# Altium schematic sheet rev02_15.SchDoc
size 282 x 200 mm
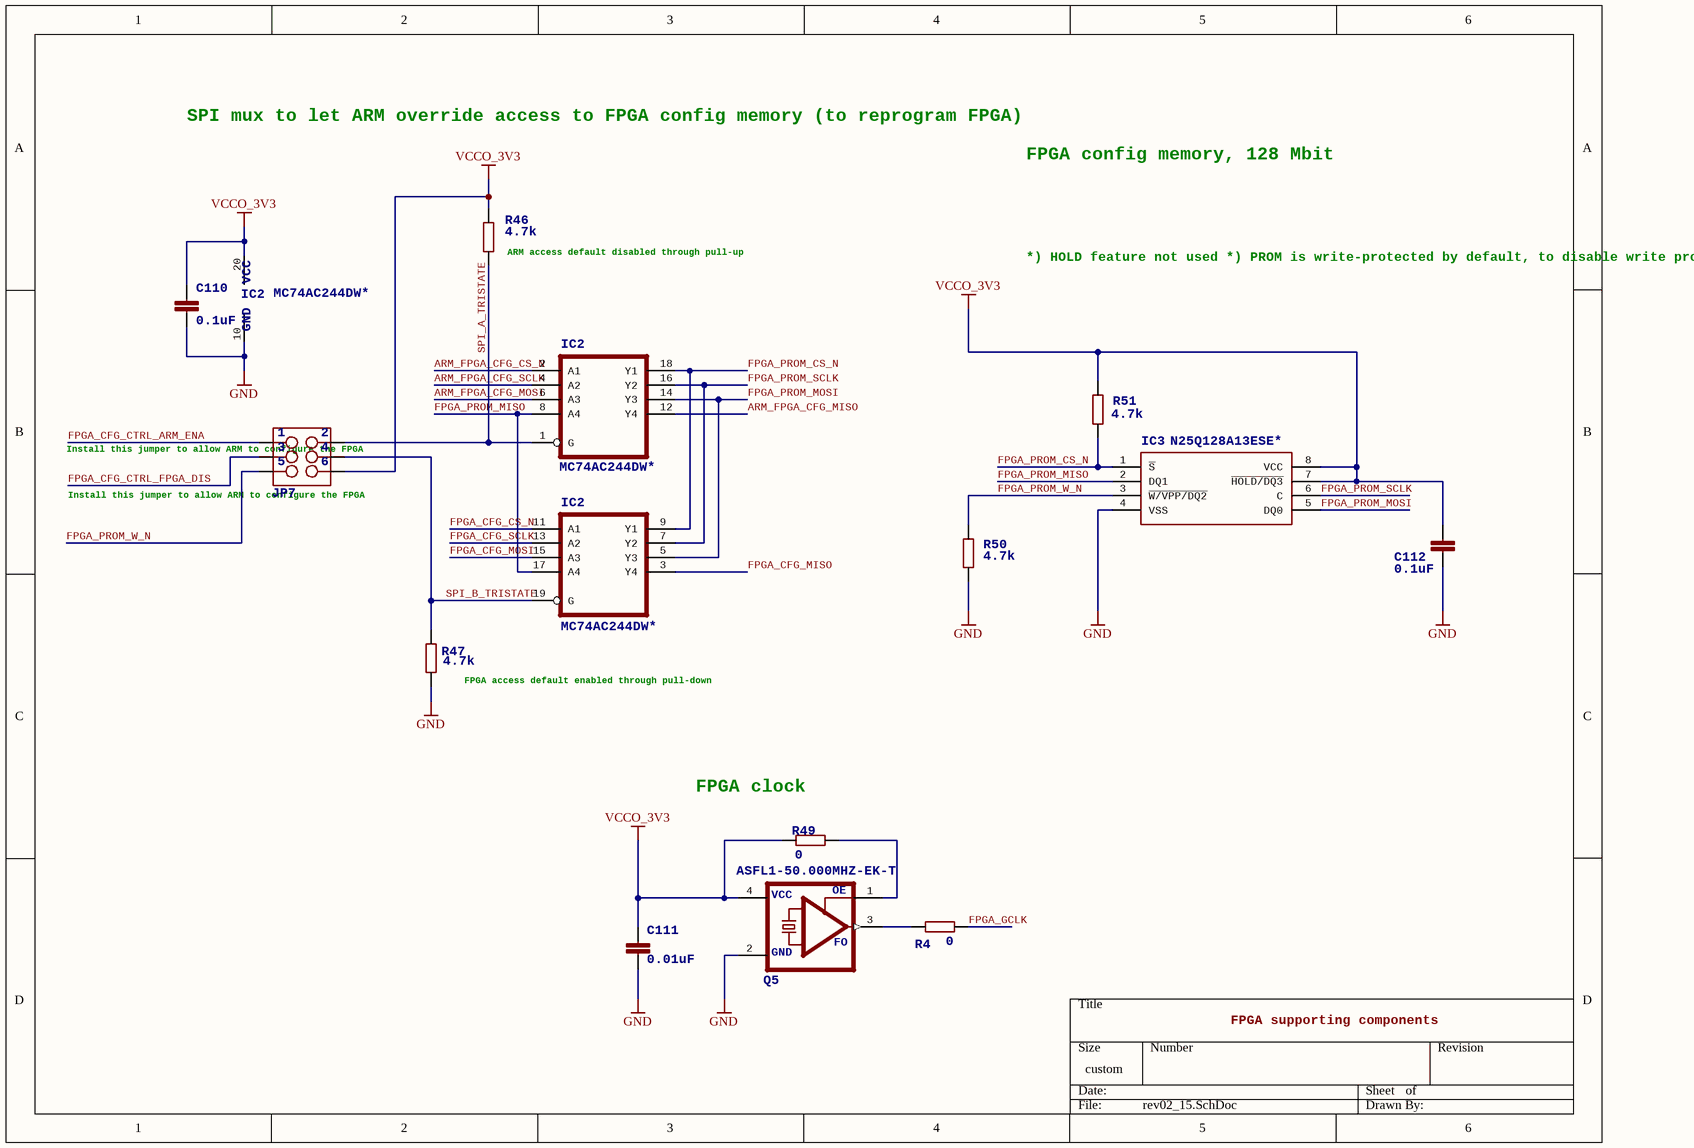
[diagram p0: rev02_15.SchDoc]

## Parts
C110  value 0.1uF  [C_0402]
C111  value 0.01uF  >NAME: C111  [C_0402]
C112  value 0.1uF  [C_0402]
IC2  MC74AC244DW*  >NAME: IC2  [SO20W]  (parts A,B,C of 3)
IC3  N25Q128A13ESE*  >Name: IC3  [SO08]
JP7  M03X2NO_SILK  [PLD-6]  (value not drawn)
Q5  ASFL1-50.000MHZ-EK-T  [ASF]
R4  value 0  >NAME: R4  [R_0402]
R46  value 4.7k  >NAME: R46  [R_0402]
R47  value 4.7k  >NAME: R47  [R_0402]
R49  value 0  >NAME: R49  [R_0402]
R50  value 4.7k  >NAME: R50  [R_0402]
R51  value 4.7k  >NAME: R51  [R_0402]

## Nets
GND: C110.2 C111.2 C112.2 IC2.10(GND) IC3.4(VSS) Q5.2(GND) R47.2 R50.1
VCCO_3V3: C110.1 C111.1 C112.1 IC2.20(VCC) IC3.7(~{HOLD/DQ3}) IC3.8(VCC) JP7.6 Q5.4(VCC) R46.2 R49.2 R51.2
ARM_FPGA_CFG_CS_N: IC2.2(A1)
ARM_FPGA_CFG_MISO: IC2.12(Y4)
ARM_FPGA_CFG_MOSI: IC2.6(A3)
ARM_FPGA_CFG_SCLK: IC2.4(A2)
FPGA_CFG_CS_N: IC2.11(A1)
FPGA_CFG_CTRL_ARM_ENA: JP7.1
FPGA_CFG_CTRL_FPGA_DIS: JP7.3
FPGA_CFG_MISO: IC2.3(Y4)
FPGA_CFG_MOSI: IC2.15(A3)
FPGA_CFG_SCLK: IC2.13(A2)
FPGA_GCLK: R4.1
FPGA_PROM_CS_N: IC2.9(Y1) IC2.18(Y1) IC3.1(~{S}) R51.1
FPGA_PROM_MISO: IC2.8(A4) IC2.17(A4) IC3.2(DQ1)
FPGA_PROM_MOSI: IC2.5(Y3) IC2.14(Y3) IC3.5(DQ0)
FPGA_PROM_SCLK: IC2.7(Y2) IC2.16(Y2) IC3.6(C)
FPGA_PROM_W_N: IC3.3(~{W/VPP/DQ2}) JP7.5 R50.2
SPI_A_TRISTATE: IC2.1(G) JP7.2 R46.1
SPI_B_TRISTATE: IC2.19(G) JP7.4 R47.1
NetQ5_1: Q5.1(OE) R49.1
NetQ5_3: Q5.3(FO) R4.2

## Notes on the sheet
- SPI mux to let ARM override access to
  FPGA config memory (to reprogram FPGA)
- FPGA config memory, 128 Mbit
- (near R46) ARM access default
  disabled through pull-up
- *) HOLD feature not used
  *) PROM is write-protected by default, to disable
  write protection (such as during firmware update),
  jumper must be inserted
- (near JP7) Install this jumper to allow
  ARM to configure the FPGA
- (near R47) FPGA access default
  enabled through pull-down
- (near R49) FPGA clock
- FPGA supporting components

## Library data of the parts
C110 C112 = C-EUC0402: 0402 CAPACITOR
C111 = C-EUC0402: 0402 CAPACITOR; DIELECTRIC: X7R; RATED_VOLTAGE: 50V; TOLERANCE: 10%
IC2 = 74*244DW: Octal BUFFER and LINE DRIVER, 3-state; >VALUE: 74*244DW
IC3 = N25Q128A13ES: NOR Flash; OC_DIGIKEY: 557-1562-ND; OC_FARNELL: 2253682; PRICE100_DIGIKEY: 1.30470; PRICE100_FARNELL: 5.10; >Value: N25Q128A13ES
JP7 = M03X2NO_SILK: 2x3 .1" header; 1: 1; 2: 2; 3: 3; 4: 4; 5: 5; 6: 6
Q5 = ASF*: CRYSTAL CLOCK OSCILLATOR. 5.0 Vdc or 3.3 Vdc - LOW PROFILE ULTRA MINIATURE CERAMIC SURFACE MOUNT. / Source: http://www.abracon.com/Oscillators/asf1-L-L1.pdf; MPN: ASFL1-125.000MHZ-EC-T; MF: Abracon Corporation; OC_FARNELL: 1838931; OC_NEWARK: 19M1882; GND: GND; VCC: VCC; FO: FO; OE: OE
R4 R46 R47 R49-R51 = R-EU_R0402: 0402 Resistor 5%
  R46 R47 R50 R51: TOLERANCE: 5%